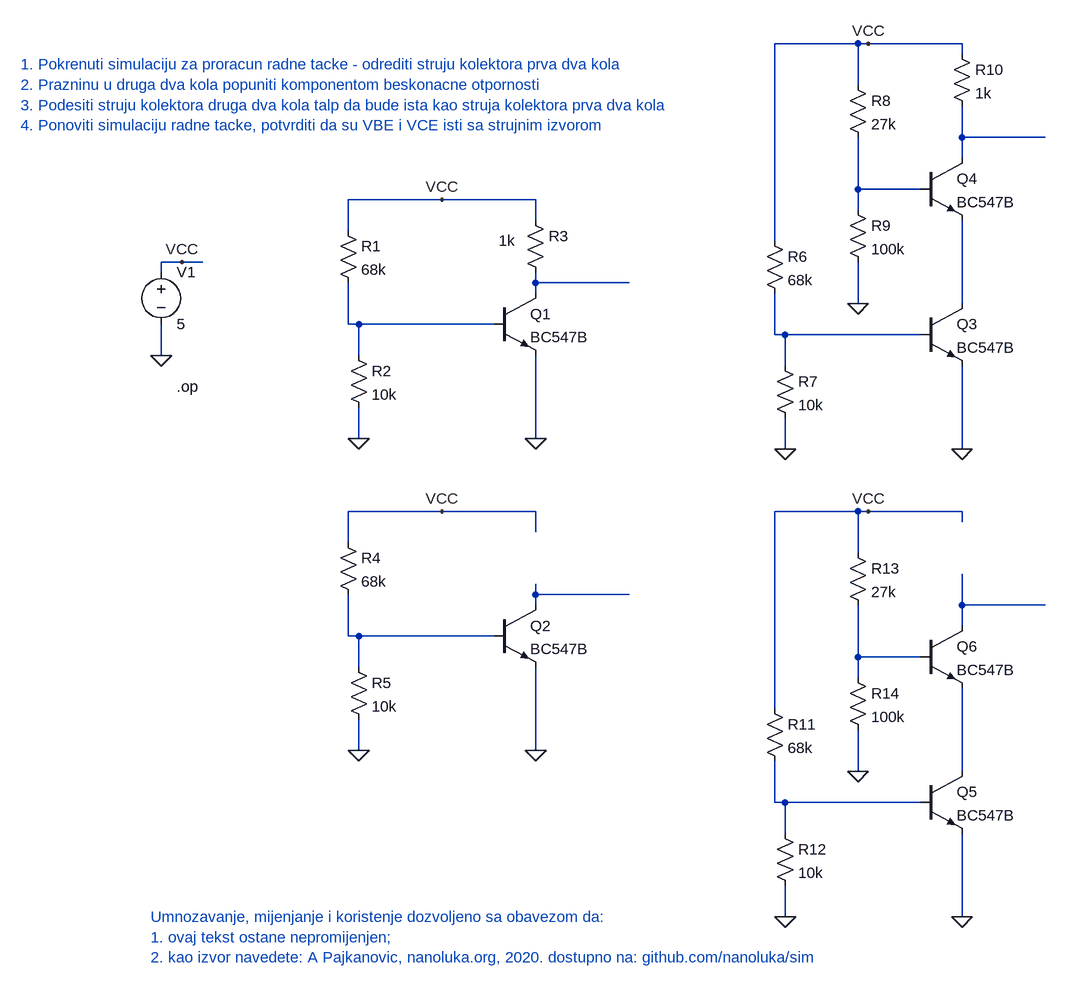
[diagram p0: schematic 01_radnaTacka_ZE-KSK.asc]
01_radnaTacka_ZE-KSK.asc, the LTspice schematic file:
Version 4
SHEET 1 3056 1132
WIRE 640 -288 512 -288
WIRE 656 -288 640 -288
WIRE 800 -288 656 -288
WIRE 800 -272 800 -288
WIRE 640 -224 640 -288
WIRE 800 -144 800 -192
WIRE 928 -144 800 -144
WIRE 800 -112 800 -144
WIRE 640 -64 640 -144
WIRE 736 -64 640 -64
WIRE 0 -48 -144 -48
WIRE 144 -48 0 -48
WIRE 640 -32 640 -64
WIRE 144 -16 144 -48
WIRE -144 0 -144 -48
WIRE 512 16 512 -288
WIRE -400 48 -432 48
WIRE -368 48 -400 48
WIRE -432 64 -432 48
WIRE 144 80 144 64
WIRE 288 80 144 80
WIRE 144 96 144 80
WIRE 640 112 640 48
WIRE 800 112 800 -16
WIRE -144 144 -144 80
WIRE -128 144 -144 144
WIRE 80 144 -128 144
WIRE 512 160 512 96
WIRE 528 160 512 160
WIRE 736 160 528 160
WIRE -432 192 -432 144
WIRE -128 192 -128 144
WIRE 528 208 528 160
WIRE -128 320 -128 272
WIRE 144 320 144 192
WIRE 528 336 528 288
WIRE 800 336 800 208
WIRE 0 432 -144 432
WIRE 144 432 0 432
WIRE 640 432 512 432
WIRE 656 432 640 432
WIRE 800 432 656 432
WIRE 800 448 800 432
WIRE 144 464 144 432
WIRE -144 480 -144 432
WIRE 640 496 640 432
WIRE 144 560 144 544
WIRE 288 560 144 560
WIRE 144 576 144 560
WIRE 800 576 800 528
WIRE 928 576 800 576
WIRE 800 608 800 576
WIRE -144 624 -144 560
WIRE -128 624 -144 624
WIRE 80 624 -128 624
WIRE 640 656 640 576
WIRE 736 656 640 656
WIRE -128 672 -128 624
WIRE 640 688 640 656
WIRE 512 736 512 432
WIRE -128 800 -128 752
WIRE 144 800 144 672
WIRE 640 832 640 768
WIRE 800 832 800 704
WIRE 512 880 512 816
WIRE 528 880 512 880
WIRE 736 880 528 880
WIRE 528 928 528 880
WIRE 528 1056 528 1008
WIRE 800 1056 800 928
FLAG -432 192 0
FLAG -128 320 0
FLAG 144 320 0
FLAG -400 48 VCC
FLAG 0 -48 VCC
FLAG -128 800 0
FLAG 144 800 0
FLAG 0 432 VCC
FLAG 528 336 0
FLAG 800 336 0
FLAG 656 -288 VCC
FLAG 640 112 0
FLAG 528 1056 0
FLAG 800 1056 0
FLAG 656 432 VCC
FLAG 640 832 0
DATAFLAG 240 80 ""
DATAFLAG 240 560 ""
DATAFLAG 672 -64 ""
DATAFLAG 896 -144 ""
DATAFLAG 672 656 ""
DATAFLAG 880 576 ""
DATAFLAG 800 48 ""
DATAFLAG 800 768 ""
SYMBOL res -160 -16 R0
SYMATTR InstName R1
SYMATTR Value 68k
SYMBOL res -144 176 R0
SYMATTR InstName R2
SYMATTR Value 10k
SYMBOL npn 80 96 R0
SYMATTR InstName Q1
SYMATTR Value BC547B
SYMBOL voltage -432 48 R0
WINDOW 123 0 0 Left 2
WINDOW 39 0 0 Left 2
SYMATTR InstName V1
SYMATTR Value 5
SYMBOL res 128 -32 R0
WINDOW 3 -41 47 Left 2
SYMATTR Value 1k
SYMATTR InstName R3
SYMBOL res -160 464 R0
SYMATTR InstName R4
SYMATTR Value 68k
SYMBOL res -144 656 R0
SYMATTR InstName R5
SYMATTR Value 10k
SYMBOL npn 80 576 R0
SYMATTR InstName Q2
SYMATTR Value BC547B
SYMBOL res 496 0 R0
SYMATTR InstName R6
SYMATTR Value 68k
SYMBOL res 512 192 R0
SYMATTR InstName R7
SYMATTR Value 10k
SYMBOL npn 736 112 R0
SYMATTR InstName Q3
SYMATTR Value BC547B
SYMBOL npn 736 -112 R0
SYMATTR InstName Q4
SYMATTR Value BC547B
SYMBOL res 624 -240 R0
SYMATTR InstName R8
SYMATTR Value 27k
SYMBOL res 624 -48 R0
SYMATTR InstName R9
SYMATTR Value 100k
SYMBOL res 784 -288 R0
SYMATTR InstName R10
SYMATTR Value 1k
SYMBOL res 496 720 R0
SYMATTR InstName R11
SYMATTR Value 68k
SYMBOL res 512 912 R0
SYMATTR InstName R12
SYMATTR Value 10k
SYMBOL npn 736 832 R0
SYMATTR InstName Q5
SYMATTR Value BC547B
SYMBOL npn 736 608 R0
SYMATTR InstName Q6
SYMATTR Value BC547B
SYMBOL res 624 480 R0
SYMATTR InstName R13
SYMATTR Value 27k
SYMBOL res 624 672 R0
SYMATTR InstName R14
SYMATTR Value 100k
TEXT -408 240 Left 2 !.op
TEXT -648 -256 Left 2 ;1. Pokrenuti simulaciju za proracun radne tacke - odrediti struju kolektora prva dva kola\n2. Prazninu u druga dva kola popuniti komponentom beskonacne otpornosti\n3. Podesiti struju kolektora druga dva kola talp da bude ista kao struja kolektora prva dva kola\n4. Ponoviti simulaciju radne tacke, potvrditi da su VBE i VCE isti sa strujnim izvorom
TEXT -448 1056 Left 2 ;Umnozavanje, mijenjanje i koristenje dozvoljeno sa obavezom da:\n1. ovaj tekst ostane nepromijenjen;\n2. kao izvor navedete: A Pajkanovic, nanoluka.org, 2020. dostupno na: github.com/nanoluka/sim

The netlist it stands for:
* 01_radnaTacka_ZE-KSK.asc
R1 VCC N005 68k
R2 N005 0 10k
Q1 N003 N005 0 0 BC547B
V1 VCC 0 5
R3 VCC N003 1k
R4 VCC N009 68k
R5 N009 0 10k
Q2 N007 N009 0 0 BC547B
R6 VCC N006 68k
R7 N006 0 10k
Q3 N004 N006 0 0 BC547B
Q4 N001 N002 N004 0 BC547B
R8 VCC N002 27k
R9 N002 0 100k
R10 VCC N001 1k
R11 VCC N012 68k
R12 N012 0 10k
Q5 N011 N012 0 0 BC547B
Q6 N008 N010 N011 0 BC547B
R13 VCC N010 27k
R14 N010 0 100k
.model NPN NPN
.model PNP PNP
.lib standard.bjt
.op
* 1. Pokrenuti simulaciju za proracun radne tacke - odrediti struju kolektora prva dva kola
* 2. Prazninu u druga dva kola popuniti komponentom beskonacne otpornosti
* 3. Podesiti struju kolektora druga dva kola talp da bude ista kao struja kolektora prva dva kola
* 4. Ponoviti simulaciju radne tacke, potvrditi da su VBE i VCE isti sa strujnim izvorom
* Umnozavanje, mijenjanje i koristenje dozvoljeno sa obavezom da:
* 1. ovaj tekst ostane nepromijenjen;
* 2. kao izvor navedete: A Pajkanovic, nanoluka.org, 2020. dostupno na: github.com/nanoluka/sim
.backanno
.end